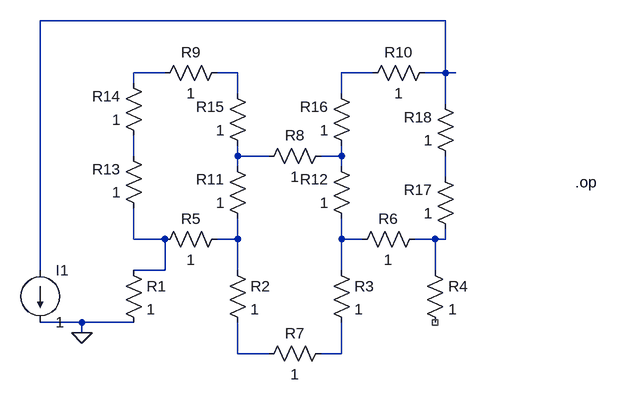
[diagram p0: schematic Draft1.asc]
Draft1.asc, the LTspice schematic file:
Version 4
SHEET 1 1028 680
WIRE 592 -112 -32 -112
WIRE 160 -32 112 -32
WIRE 272 -32 240 -32
WIRE 480 -32 432 -32
WIRE 592 -32 592 -112
WIRE 592 -32 560 -32
WIRE 608 -32 592 -32
WIRE 112 -16 112 -32
WIRE 272 0 272 -32
WIRE 432 0 432 -32
WIRE 592 16 592 -32
WIRE 112 96 112 64
WIRE 272 96 272 80
WIRE 320 96 272 96
WIRE 432 96 432 80
WIRE 432 96 400 96
WIRE 272 112 272 96
WIRE 432 112 432 96
WIRE 592 128 592 96
WIRE 112 224 112 176
WIRE 160 224 112 224
WIRE 272 224 272 192
WIRE 272 224 240 224
WIRE 432 224 432 192
WIRE 464 224 432 224
WIRE 576 224 544 224
WIRE 592 224 592 208
WIRE 592 224 576 224
WIRE -32 272 -32 -112
WIRE 160 272 160 224
WIRE 160 272 112 272
WIRE 272 272 272 224
WIRE 432 272 432 224
WIRE 576 272 576 224
WIRE 32 352 -32 352
WIRE 112 352 32 352
WIRE 32 368 32 352
WIRE 272 400 272 352
WIRE 320 400 272 400
WIRE 432 400 432 352
WIRE 432 400 400 400
FLAG 32 368 0
SYMBOL res 96 256 R0
SYMATTR InstName R1
SYMATTR Value 1
SYMBOL res 256 256 R0
SYMATTR InstName R2
SYMATTR Value 1
SYMBOL res 416 256 R0
SYMATTR InstName R3
SYMATTR Value 1
SYMBOL res 560 256 R0
SYMATTR InstName R4
SYMATTR Value 1
SYMBOL res 256 208 R90
WINDOW 0 0 56 VBottom 2
WINDOW 3 32 56 VTop 2
SYMATTR InstName R5
SYMATTR Value 1
SYMBOL res 560 208 R90
WINDOW 0 0 56 VBottom 2
WINDOW 3 32 56 VTop 2
SYMATTR InstName R6
SYMATTR Value 1
SYMBOL res 416 384 R90
WINDOW 0 0 56 VBottom 2
WINDOW 3 32 56 VTop 2
SYMATTR InstName R7
SYMATTR Value 1
SYMBOL res 416 80 R90
WINDOW 0 0 56 VBottom 2
WINDOW 3 32 56 VTop 2
SYMATTR InstName R8
SYMATTR Value 1
SYMBOL res 256 -48 R90
WINDOW 0 0 56 VBottom 2
WINDOW 3 32 56 VTop 2
SYMATTR InstName R9
SYMATTR Value 1
SYMBOL res 576 -48 R90
WINDOW 0 0 56 VBottom 2
WINDOW 3 32 56 VTop 2
SYMATTR InstName R10
SYMATTR Value 1
SYMBOL res 288 208 R180
WINDOW 0 36 76 Left 2
WINDOW 3 36 40 Left 2
SYMATTR InstName R11
SYMATTR Value 1
SYMBOL res 448 208 R180
WINDOW 0 36 76 Left 2
WINDOW 3 36 40 Left 2
SYMATTR InstName R12
SYMATTR Value 1
SYMBOL res 128 192 R180
WINDOW 0 36 76 Left 2
WINDOW 3 36 40 Left 2
SYMATTR InstName R13
SYMATTR Value 1
SYMBOL res 128 80 R180
WINDOW 0 36 76 Left 2
WINDOW 3 36 40 Left 2
SYMATTR InstName R14
SYMATTR Value 1
SYMBOL res 288 96 R180
WINDOW 0 36 76 Left 2
WINDOW 3 36 40 Left 2
SYMATTR InstName R15
SYMATTR Value 1
SYMBOL res 448 96 R180
WINDOW 0 36 76 Left 2
WINDOW 3 36 40 Left 2
SYMATTR InstName R16
SYMATTR Value 1
SYMBOL res 608 224 R180
WINDOW 0 36 76 Left 2
WINDOW 3 36 40 Left 2
SYMATTR InstName R17
SYMATTR Value 1
SYMBOL res 608 112 R180
WINDOW 0 36 76 Left 2
WINDOW 3 36 40 Left 2
SYMATTR InstName R18
SYMATTR Value 1
SYMBOL current -32 272 R0
SYMATTR InstName I1
SYMATTR Value 1
TEXT 792 136 Left 2 !.op

The netlist it stands for:
* Draft1.asc
R1 N009 0 1
R2 N010 N013 1
R3 N011 N014 1
R4 N012 NC_01 1
R5 N010 N009 1
R6 N012 N011 1
R7 N014 N013 1
R8 N007 N006 1
R9 N003 N002 1
R10 N001 N004 1
R11 N010 N006 1
R12 N011 N007 1
R13 N009 N005 1
R14 N005 N002 1
R15 N006 N003 1
R16 N007 N004 1
R17 N012 N008 1
R18 N008 N001 1
I1 N001 0 1
.op
.backanno
.end